# Altium project APD-PS_V2.PRJPCB
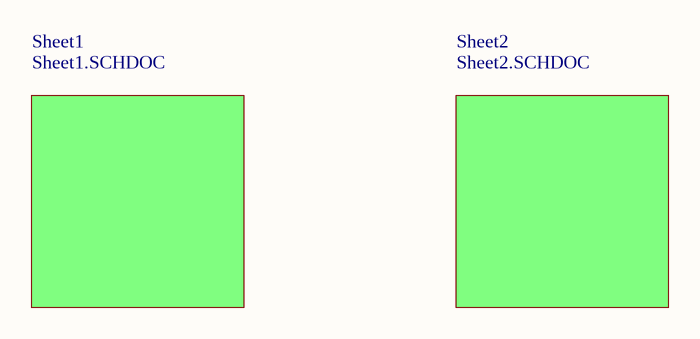
[diagram p0: First_Sheet.SCHDOC]
3 sheets, 53 parts. Net scope: global (net labels, ports and power ports of the same name join across sheets).
Sheets:
  First_Sheet.SCHDOC
    Sheet1 = Sheet1.SCHDOC
    Sheet2 = Sheet2.SCHDOC

## Sheet First_Sheet.SCHDOC
size 619 x 449 mm

### Sub-sheets
Sheet1 = Sheet1.SCHDOC: no entries
Sheet2 = Sheet2.SCHDOC: no entries

## Sheet Sheet1.SCHDOC
size 619 x 449 mm; SheetNumber: 1; SheetTotal: 2; DocumentName: Sheet1.SCHDOC
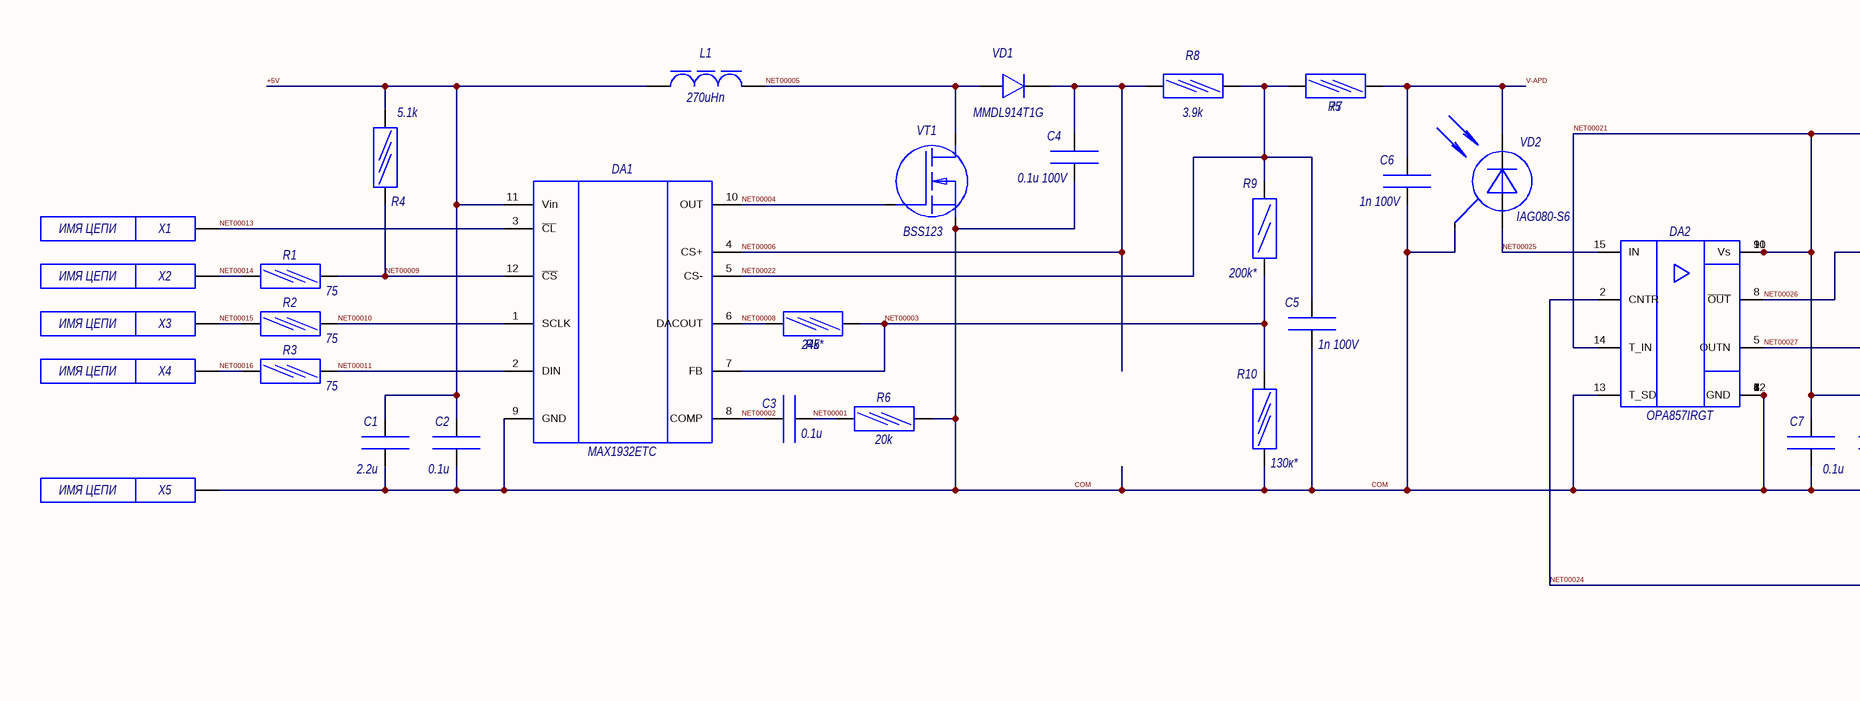
[diagram p1: Sheet1.SCHDOC, left]
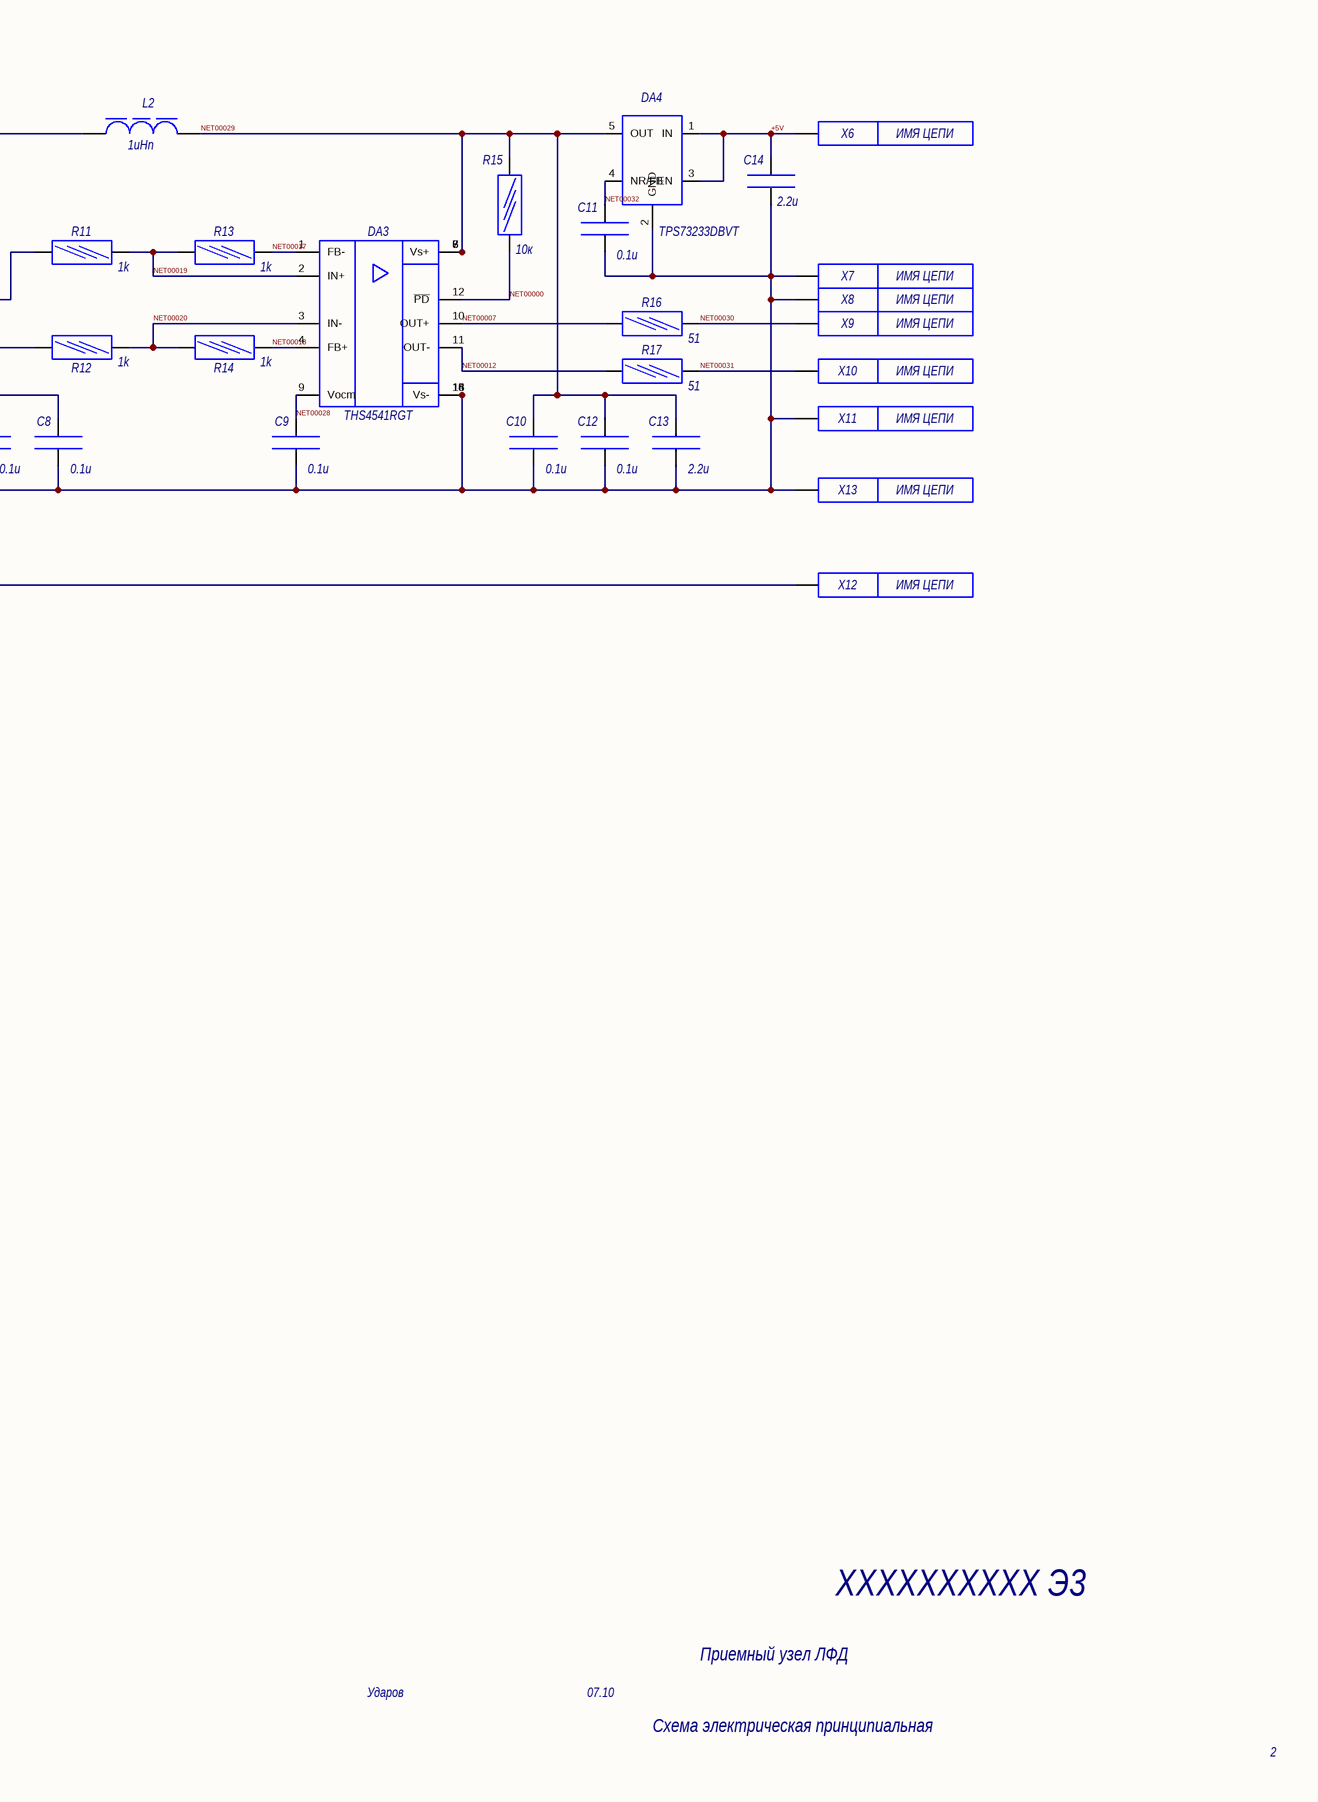
[diagram p2: Sheet1.SCHDOC, right]

### Parts
C1  value 2.2u  [0805_C0805()]
C2  value 0.1u  [0402_C0402()]
C3  value 0.1u  [0402_C0402()]
C4  value 0.1u 100V  [0805_C0805()]
C5  value 1n 100V  [0805_C0805()]
C6  value 1n 100V  [0805_C0805()]
C7  value 0.1u  [0402_C0402()]
C8  value 0.1u  [0402_C0402()]
C9  value 0.1u  [0402_C0402()]
C10  value 0.1u  [0402_C0402()]
C11  value 0.1u  [0402_C0402()]
C12  value 0.1u  [0402_C0402()]
C13  value 2.2u  [0805_C0805()]
C14  value 2.2u  [0805_C0805()]
DA1  value MAX1932ETC  [TQFN-12_MAX1932()]
DA2  value OPA857IRGT  [VQFN-16_OPA857()]
DA3  value THS4541RGT  [VQFN-16_THS4541RGT()]
DA4  value TPS73233DBVT  [SOT23-5_TPS736XX()]
L1  value 270uHn  [L1210_L1210()]
L2  value 1uHn  [L0805_L0805()]
R1  value 75  [0402_R0402()]
R2  value 75  [0402_R0402()]
R3  value 75  [0402_R0402()]
R4  value 5.1k  [0402_R0402()]
R5  value 24k*  [0402_R0402()]
R6  value 20k  [0402_R0402()]
R7  value 75  [0402_R0402()]
R8  value 3.9k  [0603_R0603()]
R9  value 200k*  [0805_R0805()]
R10  value 130к*  [0402_R0402()]
R11  value 1k  [0402_R0402()]
R12  value 1k  [0402_R0402()]
R13  value 1k  [0402_R0402()]
R14  value 1k  [0402_R0402()]
R15  value 10к  [0402_R0402()]
R16  value 51  [0402_R0402()]
R17  value 51  [0402_R0402()]
VD1  value MMDL914T1G  [SOD110_BAS216()]
VD2  value IAG080-S6  [TO-46_IAG080-S6()]
VT1  value BSS123  [SOT23_IRLML2803()]
X1  Reference: ИМЯ ЦЕПИ  [CONTPOINT_CONTPOINT()]
X2  Reference: ИМЯ ЦЕПИ  [CONTPOINT_CONTPOINT()]
X3  Reference: ИМЯ ЦЕПИ  [CONTPOINT_CONTPOINT()]
X4  Reference: ИМЯ ЦЕПИ  [CONTPOINT_CONTPOINT()]
X5  Reference: ИМЯ ЦЕПИ  [CONTPOINT_CONTPOINT()]
X6  Reference: ИМЯ ЦЕПИ  [CONTPOINT_CONTPOINT()]
X7  Reference: ИМЯ ЦЕПИ  [CONTPOINT_CONTPOINT()]
X8  Reference: ИМЯ ЦЕПИ  [CONTPOINT_CONTPOINT()]
X9  Reference: ИМЯ ЦЕПИ  [CONTPOINT_CONTPOINT()]
X10  Reference: ИМЯ ЦЕПИ  [CONTPOINT_CONTPOINT()]
X11  Reference: ИМЯ ЦЕПИ  [CONTPOINT_CONTPOINT()]
X12  Reference: ИМЯ ЦЕПИ  [CONTPOINT_CONTPOINT()]
X13  Reference: ИМЯ ЦЕПИ  [CONTPOINT_CONTPOINT()]

### Nets
+5V: C1.2 C2.2 C14.2 DA1.11(Vin) DA4.1(IN) DA4.3(EN) L1.1 R4.1 X6.1
COM: C1.1 C2.1 C4.1 C5.1 C6.1 C7.1 C8.1 C9.1 C10.1 C11.1 C12.1 C13.1 C14.1 DA1.9(GND) DA2.1(GND) DA2.3(GND) DA2.4(GND) DA2.6(GND) DA2.7(GND) DA2.12(GND) DA2.13(T_SD) DA3.13(Vs-) DA3.14(Vs-) DA3.15(Vs-) DA3.16(Vs-) DA4.2(GND) R6.2 R10.2 VD2.2(Case) VT1.3(S) X5.1 X7.1 X8.1 X11.1 X13.1
NET00000: DA3.12(~{PD}) R15.2
NET00001: C3.1 R6.1
NET00002: C3.2 DA1.8(COMP)
NET00003: DA1.7(FB) R5.1 R9.1 R10.1
NET00004: DA1.10(OUT) VT1.1(G)
NET00005: L1.2 VD1.1(A) VT1.2(D)
NET00006: C4.2 DA1.4(CS+) R8.1 VD1.2(K)
NET00007: DA3.10(OUT+) R16.1
NET00008: DA1.6(DACOUT) R5.2
NET00009: DA1.12(~{CS}) R1.2 R4.2
NET00010: DA1.1(SCLK) R2.2
NET00011: DA1.2(DIN) R3.2
NET00012: DA3.11(OUT-) R17.1
NET00013: DA1.3(~{CL}) X1.1
NET00014: R1.1 X2.1
NET00015: R2.1 X3.1
NET00016: R3.1 X4.1
NET00017: DA3.1(FB-) R13.2
NET00018: DA3.4(FB+) R14.2
NET00019: DA3.2(IN+) R11.2 R13.1
NET00020: DA3.3(IN-) R12.2 R14.1
NET00021: C7.2 C8.2 DA2.9(Vs) DA2.10(Vs) DA2.11(Vs) DA2.14(T_IN) L2.1
NET00022: C5.2 DA1.5(CS-) R7.2 R8.2 R9.2
NET00024: DA2.2(CNTR) X12.1
NET00025: DA2.15(IN) VD2.3(A)
NET00026: DA2.8(~{OUT}) R11.1
NET00027: DA2.5(OUTN) R12.1
NET00028: C9.2 DA3.9(Vocm)
NET00029: C10.2 C12.2 C13.2 DA3.5(Vs+) DA3.6(Vs+) DA3.7(Vs+) DA3.8(Vs+) DA4.5(OUT) L2.2 R15.1
NET00030: R16.2 X9.1
NET00031: R17.2 X10.1
NET00032: C11.2 DA4.4(NR/FB)
V-APD: C6.2 R7.1 VD2.1(C)

Not connected (* = marked no-connect by the designer): DA1 13; DA2 16 17; DA3 17

### Notes on the sheet
- XXXXXXXXXX Э3
- Ударов
- 07.10
- Схема электрическая принципиальная
- Приемный узел ЛФД
- 2
- Перв. примен.
- Справ №
- Подп. и дата
- Инв. № дубл.
- Взамен инв. №
- Лит.
- Масса
- Масштаб
- Изм.
- Разраб.
- Лист
- № докум.
- Подпись
- Дата
- Инв № подл.
- Т.контр.
- Пров.
- Листов
- Формат А2
- Утв.
- Н.контр.

### Library data of the parts
C1 C4-C6 C13 C14 = C0805
C2 C3 C7-C12 = C0402
DA1 = MAX1932: Description: Safest APD Bias Supply
DA2 = OPA857: Description: TransImpedanceAmpl
DA3 = THS4541RGT: Description: Fully Differential Amplifier 850MHz
DA4 = TPS736XX: Description: Low Drop Linear fixed / voltage stabilizator
L1 = L1210: Description: LQH32MN271K23L
L2 = L0805: Description: LQM21NN1R0K
R1-R7 R10-R17 = R0402
R8 = R0603
R9 = R0805
VD1 = BAS216: Description: Silicon Rectifier Diode
VD2 = IAG080-S6
VT1 = IRLML2803: Description: HEXFET Power MOSFET
X1-X13 = CONTPOINT: Value: *

## Sheet Sheet2.SCHDOC
size 619 x 449 mm; SheetNumber: 2; SheetTotal: 2; DocumentName: Sheet2.SCHDOC
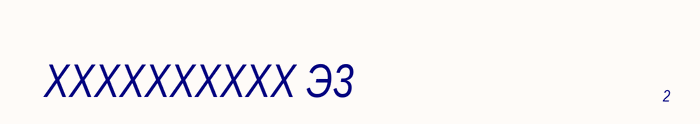
[diagram p3: Sheet2.SCHDOC]

### Notes on the sheet
- XXXXXXXXXX Э3
- 2
- Подп. и дата
- Инв. № дубл.
- Взамен инв. №
- Инв. № подл.
- Лист
- Изм.
- № докум.
- Подпись
- Дата
- Копировал
- Формат А3